# EAGLE design Orbiter_V1 (EAGLE 8.3.2)
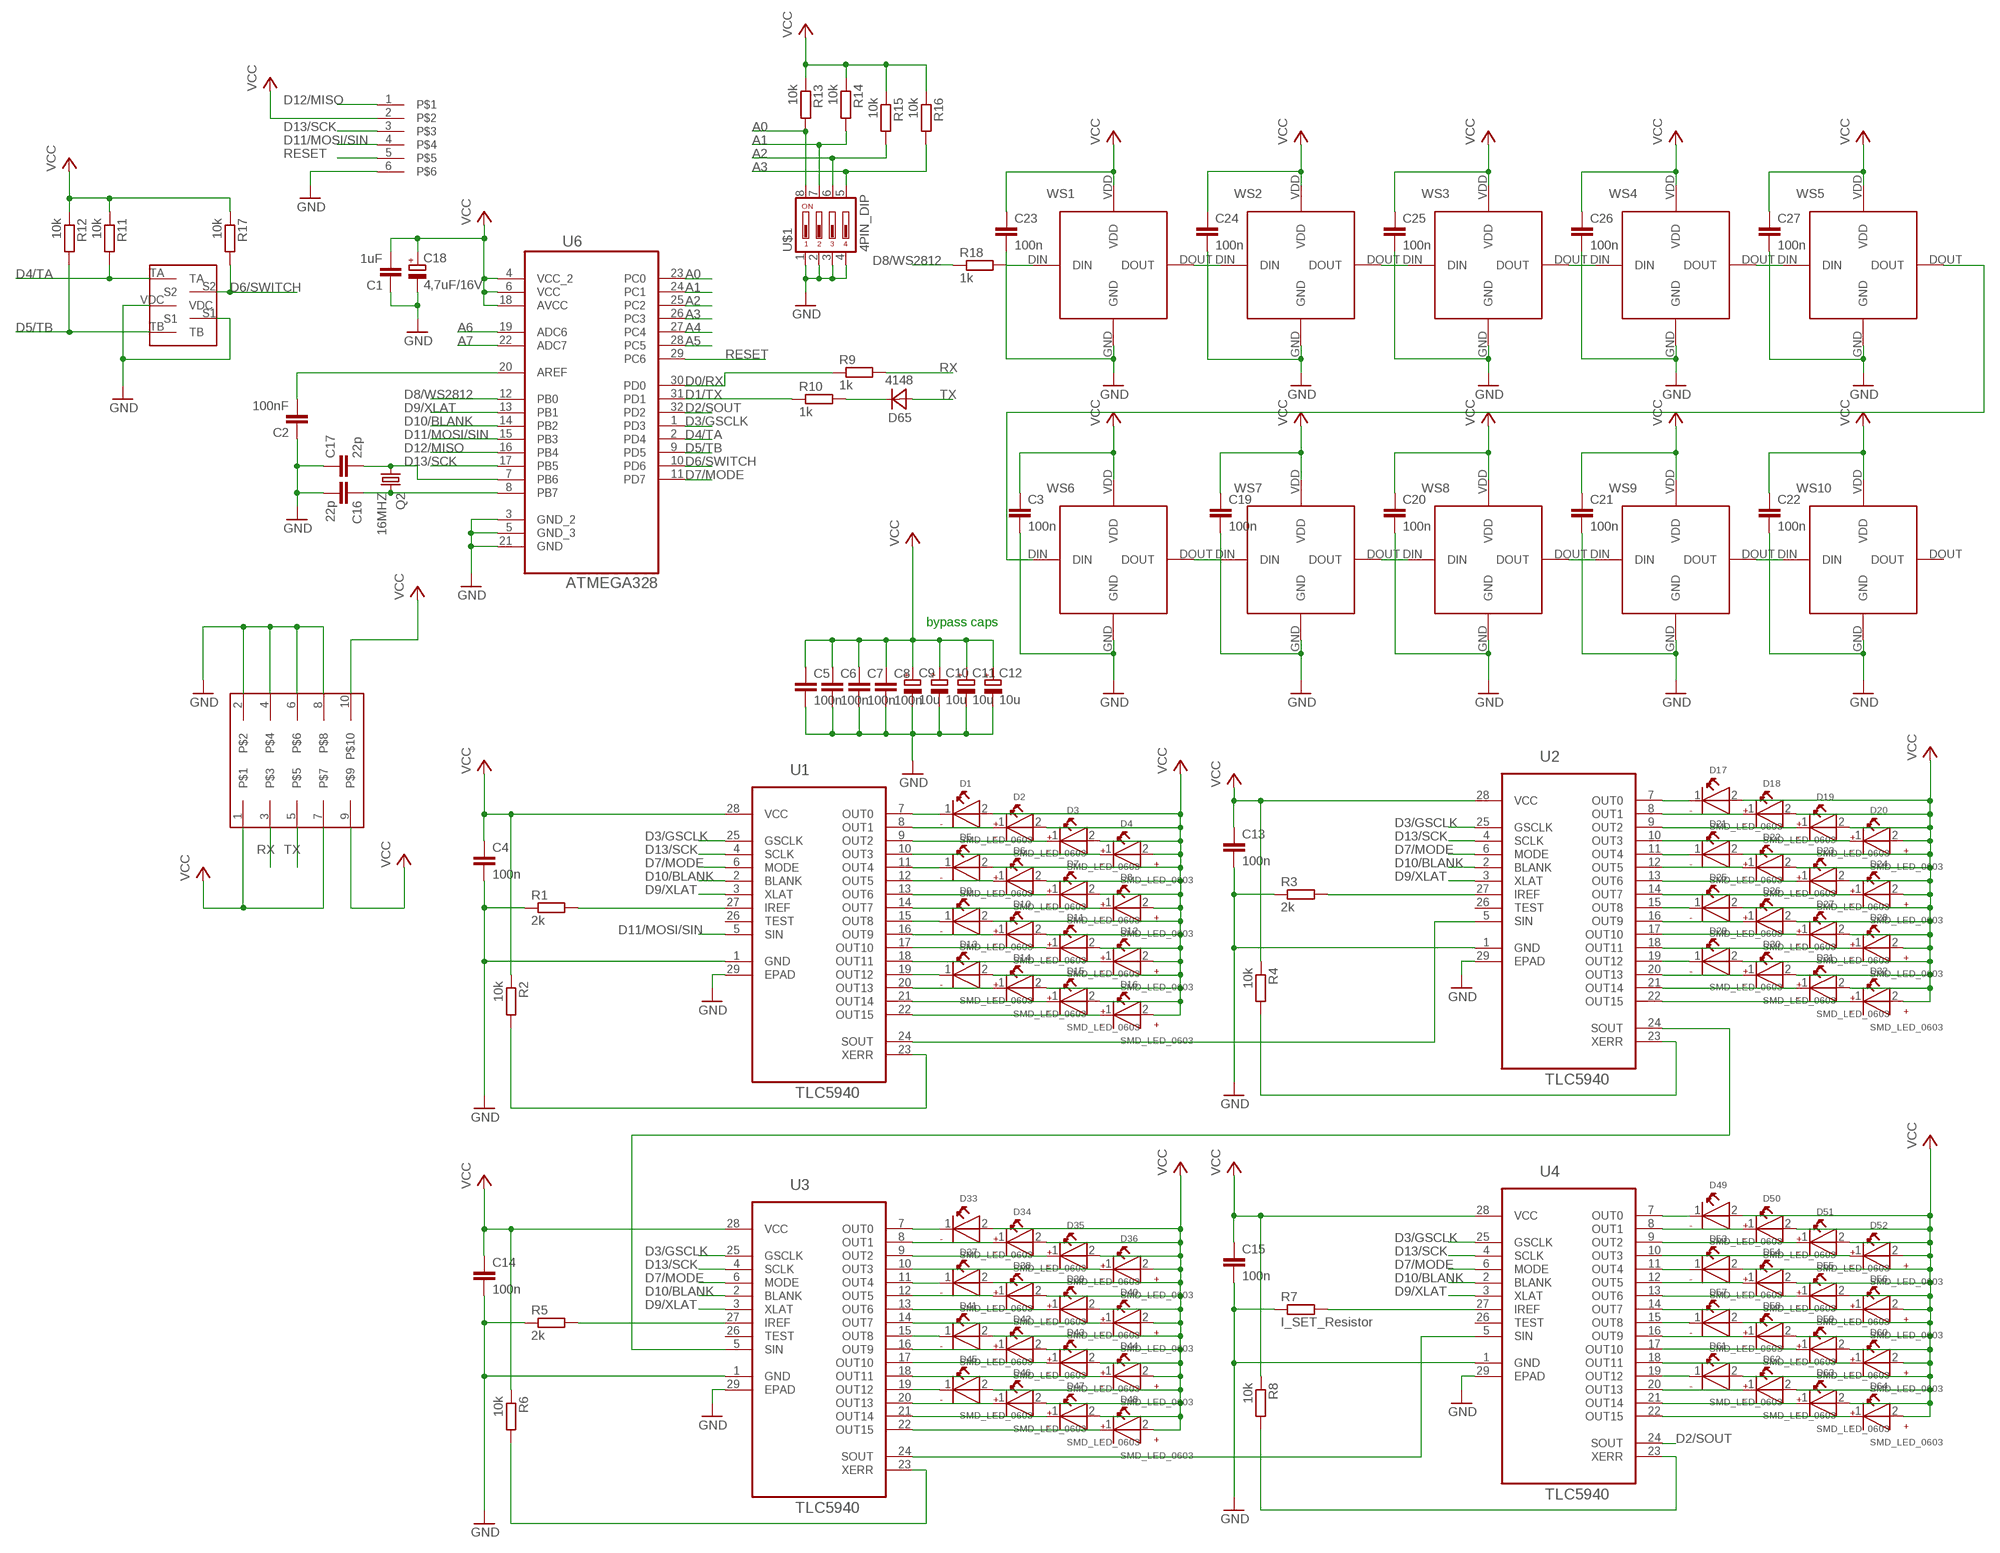
[diagram p0: schematic, sheet 1]

## Parts
C1  1uF  KONDENSATOR_0603  [C0603]
C2  100nF  KONDENSATOR_0603  [C0603]
C3  100n  KONDENSATOR_0603  [C0603]
C4  100n  KONDENSATOR_0603  [C0603]
C5  100n  KONDENSATOR_0603  [C0603]
C6  100n  KONDENSATOR_0603  [C0603]
C7  100n  KONDENSATOR_0603  [C0603]
C8  100n  KONDENSATOR_0603  [C0603]
C9  10u  SMD_ELCTROLYTIC  [153CLV-0605]
C10  10u  SMD_ELCTROLYTIC  [153CLV-0605]
C11  10u  SMD_ELCTROLYTIC  [153CLV-0605]
C12  10u  SMD_ELCTROLYTIC  [153CLV-0605]
C13  100n  KONDENSATOR_0603  [C0603]
C14  100n  KONDENSATOR_0603  [C0603]
C15  100n  KONDENSATOR_0603  [C0603]
C16  22p  KONDENSATOR_0603  [C0603]
C17  22p  KONDENSATOR_0603  [C0603]
C18  4,7uF/16V  SMD_ELCTROLYTIC  [153CLV-0605]
C19  100n  KONDENSATOR_0603  [C0603]
C20  100n  KONDENSATOR_0603  [C0603]
C21  100n  KONDENSATOR_0603  [C0603]
C22  100n  KONDENSATOR_0603  [C0603]
C23  100n  KONDENSATOR_0603  [C0603]
C24  100n  KONDENSATOR_0603  [C0603]
C25  100n  KONDENSATOR_0603  [C0603]
C26  100n  KONDENSATOR_0603  [C0603]
C27  100n  KONDENSATOR_0603  [C0603]
D1  SMD_LED_0603  [WL-SMCW_0603]
D2  SMD_LED_0603  [WL-SMCW_0603]
D3  SMD_LED_0603  [WL-SMCW_0603]
D4  SMD_LED_0603  [WL-SMCW_0603]
D5  SMD_LED_0603  [WL-SMCW_0603]
D6  SMD_LED_0603  [WL-SMCW_0603]
D7  SMD_LED_0603  [WL-SMCW_0603]
D8  SMD_LED_0603  [WL-SMCW_0603]
D9  SMD_LED_0603  [WL-SMCW_0603]
D10  SMD_LED_0603  [WL-SMCW_0603]
D11  SMD_LED_0603  [WL-SMCW_0603]
D12  SMD_LED_0603  [WL-SMCW_0603]
D13  SMD_LED_0603  [WL-SMCW_0603]
D14  SMD_LED_0603  [WL-SMCW_0603]
D15  SMD_LED_0603  [WL-SMCW_0603]
D16  SMD_LED_0603  [WL-SMCW_0603]
D17  SMD_LED_0603  [WL-SMCW_0603]
D18  SMD_LED_0603  [WL-SMCW_0603]
D19  SMD_LED_0603  [WL-SMCW_0603]
D20  SMD_LED_0603  [WL-SMCW_0603]
D21  SMD_LED_0603  [WL-SMCW_0603]
D22  SMD_LED_0603  [WL-SMCW_0603]
D23  SMD_LED_0603  [WL-SMCW_0603]
D24  SMD_LED_0603  [WL-SMCW_0603]
D25  SMD_LED_0603  [WL-SMCW_0603]
D26  SMD_LED_0603  [WL-SMCW_0603]
D27  SMD_LED_0603  [WL-SMCW_0603]
D28  SMD_LED_0603  [WL-SMCW_0603]
D29  SMD_LED_0603  [WL-SMCW_0603]
D30  SMD_LED_0603  [WL-SMCW_0603]
D31  SMD_LED_0603  [WL-SMCW_0603]
D32  SMD_LED_0603  [WL-SMCW_0603]
D33  SMD_LED_0603  [WL-SMCW_0603]
D34  SMD_LED_0603  [WL-SMCW_0603]
D35  SMD_LED_0603  [WL-SMCW_0603]
D36  SMD_LED_0603  [WL-SMCW_0603]
D37  SMD_LED_0603  [WL-SMCW_0603]
D38  SMD_LED_0603  [WL-SMCW_0603]
D39  SMD_LED_0603  [WL-SMCW_0603]
D40  SMD_LED_0603  [WL-SMCW_0603]
D41  SMD_LED_0603  [WL-SMCW_0603]
D42  SMD_LED_0603  [WL-SMCW_0603]
D43  SMD_LED_0603  [WL-SMCW_0603]
D44  SMD_LED_0603  [WL-SMCW_0603]
D45  SMD_LED_0603  [WL-SMCW_0603]
D46  SMD_LED_0603  [WL-SMCW_0603]
D47  SMD_LED_0603  [WL-SMCW_0603]
D48  SMD_LED_0603  [WL-SMCW_0603]
D49  SMD_LED_0603  [WL-SMCW_0603]
D50  SMD_LED_0603  [WL-SMCW_0603]
D51  SMD_LED_0603  [WL-SMCW_0603]
D52  SMD_LED_0603  [WL-SMCW_0603]
D53  SMD_LED_0603  [WL-SMCW_0603]
D54  SMD_LED_0603  [WL-SMCW_0603]
D55  SMD_LED_0603  [WL-SMCW_0603]
D56  SMD_LED_0603  [WL-SMCW_0603]
D57  SMD_LED_0603  [WL-SMCW_0603]
D58  SMD_LED_0603  [WL-SMCW_0603]
D59  SMD_LED_0603  [WL-SMCW_0603]
D60  SMD_LED_0603  [WL-SMCW_0603]
D61  SMD_LED_0603  [WL-SMCW_0603]
D62  SMD_LED_0603  [WL-SMCW_0603]
D63  SMD_LED_0603  [WL-SMCW_0603]
D64  SMD_LED_0603  [WL-SMCW_0603]
D65  4148  4148_SOD323  [SOD323-R]
Q2  16MHZ  CRYSTAL_SM49  [SM49]
R1  2k  WIDERSTAND_0805R0805  [R0805]
R2  10k  WIDERSTAND_0805R0805  [R0805]
R3  2k  WIDERSTAND_0805R0805  [R0805]
R4  10k  WIDERSTAND_0805R0805  [R0805]
R5  2k  WIDERSTAND_0805R0805  [R0805]
R6  10k  WIDERSTAND_0805R0805  [R0805]
R7  I_SET_Resistor  WIDERSTAND_0805R0805  [R0805]
R8  10k  WIDERSTAND_0805R0805  [R0805]
R9  1k  WIDERSTAND_0805R0805  [R0805]
R10  1k  WIDERSTAND_0805R0805  [R0805]
R11  10k  WIDERSTAND_0805R0805  [R0805]
R12  10k  WIDERSTAND_0805R0805  [R0805]
R13  10k  WIDERSTAND_0805R0805  [R0805]
R14  10k  WIDERSTAND_0805R0805  [R0805]
R15  10k  WIDERSTAND_0805R0805  [R0805]
R16  10k  WIDERSTAND_0805R0805  [R0805]
R17  10k  WIDERSTAND_0805R0805  [R0805]
R18  1k  WIDERSTAND_0805R0805  [R0805]
U1  TLC5940  TLC59401PWP  [SOP65P640X120-29N]
U2  TLC5940  TLC59401PWP  [SOP65P640X120-29N]
U3  TLC5940  TLC59401PWP  [SOP65P640X120-29N]
U4  TLC5940  TLC59401PWP  [SOP65P640X120-29N]
U6  ATMEGA328  ATMEGA328P-AU  [QFP80P900X900X120-32N]
U$1  4PIN_DIP  [CTS-219-04]
U$2  10PIN_HEADER_SMD  [87832-10]
U$3  6PIN_HEADER_SMD_OPEN  [6PIN_HEADER_SMD_OPEN]
U$4  BOURNS_ENCODER  [BOURNS_ENCODER_SMD]
WS1  WS2812  [WS2812]
WS2  WS2812  [WS2812]
WS3  WS2812  [WS2812]
WS4  WS2812  [WS2812]
WS5  WS2812  [WS2812]
WS6  WS2812  [WS2812]
WS7  WS2812  [WS2812]
WS8  WS2812  [WS2812]
WS9  WS2812  [WS2812]
WS10  WS2812  [WS2812]

## Nets
A0: R13.2 U6.23(PC0) U$1.8
A1: R14.2 U6.24(PC1) U$1.7
A2: R15.2 U6.25(PC2) U$1.6
A3: R16.2 U6.26(PC3) U$1.5
A4: U6.27(PC4)
A5: U6.28(PC5)
A6: U6.19(ADC6)
A7: U6.22(ADC7)
D0/RX: R9.1 U6.30(PD0)
D1/TX: R10.1 U6.31(PD1)
D2/SOUT: U4.24(SOUT) U6.32(PD2)
D3/GSCLK: U1.25(GSCLK) U2.25(GSCLK) U3.25(GSCLK) U4.25(GSCLK) U6.1(PD3)
D4/TA: R11.2 U6.2(PD4) U$4.TA
D5/TB: R12.2 U6.9(PD5) U$4.TB
D6/SWITCH: R17.2 U6.10(PD6) U$4.S2
D7/MODE: U1.6(MODE) U2.6(MODE) U3.6(MODE) U4.6(MODE) U6.11(PD7)
D8/WS2812: R18.1 U6.12(PB0)
D9/XLAT: U1.3(XLAT) U2.3(XLAT) U3.3(XLAT) U4.3(XLAT) U6.13(PB1)
D10/BLANK: U1.2(BLANK) U2.2(BLANK) U3.2(BLANK) U4.2(BLANK) U6.14(PB2)
D11/MOSI/SIN: U1.5(SIN) U6.15(PB3) U$3.4
D12/MISO: U6.16(PB4) U$3.1
D13/SCK: U1.4(SCLK) U2.4(SCLK) U3.4(SCLK) U4.4(SCLK) U6.17(PB5) U$3.3
GND: C1.1 C2.1 C3.2 C4.2 C5.2 C6.2 C7.2 C8.2 C9.- C10.- C11.- C12.- C13.2 C14.2 C15.2 C16.2 C17.1 C18.- C19.2 C20.2 C21.2 C22.2 C23.2 C24.2 C25.2 C26.2 C27.2 R1.1 R3.1 R5.1 R7.1 U1.1(GND) U1.29(EPAD) U2.1(GND) U2.29(EPAD) U3.1(GND) U3.29(EPAD) U4.1(GND) U4.29(EPAD) U6.3(GND_2) U6.5(GND_3) U6.21(GND) U$1.1 U$1.2 U$1.3 U$1.4 U$2.2 U$2.4 U$2.6 U$2.8 U$3.6 U$4.S1 U$4.VDC WS1.GND WS2.GND WS3.GND WS4.GND WS5.GND WS6.GND WS7.GND WS8.GND WS9.GND WS10.GND
N$1: D1.1(-) U1.7(OUT0)
N$2: R1.2 U1.27(IREF)
N$3: D2.1(-) U1.8(OUT1)
N$4: D8.1(-) U1.14(OUT7)
N$5: D3.1(-) U1.9(OUT2)
N$6: D9.1(-) U1.15(OUT8)
N$7: D4.1(-) U1.10(OUT3)
N$8: D10.1(-) U1.16(OUT9)
N$9: D5.1(-) U1.11(OUT4)
N$10: D6.1(-) U1.12(OUT5)
N$11: D7.1(-) U1.13(OUT6)
N$12: D11.1(-) U1.17(OUT10)
N$13: D12.1(-) U1.18(OUT11)
N$14: D13.1(-) U1.19(OUT12)
N$15: D14.1(-) U1.20(OUT13)
N$16: D15.1(-) U1.21(OUT14)
N$17: D16.1(-) U1.22(OUT15)
N$18: R2.2 U1.23(XERR)
N$19: D17.1(-) U2.7(OUT0)
N$20: D18.1(-) U2.8(OUT1)
N$21: D19.1(-) U2.9(OUT2)
N$22: D20.1(-) U2.10(OUT3)
N$23: D21.1(-) U2.11(OUT4)
N$24: D22.1(-) U2.12(OUT5)
N$25: D23.1(-) U2.13(OUT6)
N$26: D24.1(-) U2.14(OUT7)
N$27: D25.1(-) U2.15(OUT8)
N$28: D26.1(-) U2.16(OUT9)
N$29: D27.1(-) U2.17(OUT10)
N$30: U1.24(SOUT) U2.5(SIN)
N$31: D28.1(-) U2.18(OUT11)
N$32: D29.1(-) U2.19(OUT12)
N$33: D30.1(-) U2.20(OUT13)
N$34: D31.1(-) U2.21(OUT14)
N$35: D32.1(-) U2.22(OUT15)
N$36: R3.2 U2.27(IREF)
N$37: R4.2 U2.23(XERR)
N$38: U2.24(SOUT) U3.5(SIN)
N$39: D33.1(-) U3.7(OUT0)
N$40: D34.1(-) U3.8(OUT1)
N$41: D35.1(-) U3.9(OUT2)
N$42: D36.1(-) U3.10(OUT3)
N$43: D37.1(-) U3.11(OUT4)
N$44: D38.1(-) U3.12(OUT5)
N$45: D39.1(-) U3.13(OUT6)
N$46: D40.1(-) U3.14(OUT7)
N$47: D41.1(-) U3.15(OUT8)
N$48: D42.1(-) U3.16(OUT9)
N$49: D43.1(-) U3.17(OUT10)
N$50: D44.1(-) U3.18(OUT11)
N$51: D45.1(-) U3.19(OUT12)
N$52: D46.1(-) U3.20(OUT13)
N$53: D47.1(-) U3.21(OUT14)
N$54: D48.1(-) U3.22(OUT15)
N$55: R5.2 U3.27(IREF)
N$56: R6.2 U3.23(XERR)
N$57: U3.24(SOUT) U4.5(SIN)
N$58: D49.1(-) U4.7(OUT0)
N$59: D50.1(-) U4.8(OUT1)
N$60: D51.1(-) U4.9(OUT2)
N$61: D52.1(-) U4.10(OUT3)
N$62: D53.1(-) U4.11(OUT4)
N$63: D54.1(-) U4.12(OUT5)
N$64: D55.1(-) U4.13(OUT6)
N$65: D56.1(-) U4.14(OUT7)
N$66: D57.1(-) U4.15(OUT8)
N$67: D58.1(-) U4.16(OUT9)
N$68: D59.1(-) U4.17(OUT10)
N$69: D60.1(-) U4.18(OUT11)
N$70: D61.1(-) U4.19(OUT12)
N$71: D62.1(-) U4.20(OUT13)
N$72: D63.1(-) U4.21(OUT14)
N$73: D64.1(-) U4.22(OUT15)
N$74: R7.2 U4.27(IREF)
N$75: R8.2 U4.23(XERR)
N$76: WS1.DOUT WS2.DIN
N$77: D65.C R10.2
N$78: R18.2 WS1.DIN
N$79: WS2.DOUT WS3.DIN
N$80: WS3.DOUT WS4.DIN
N$81: C17.2 Q2.1 U6.7(PB6)
N$82: C16.1 Q2.2 U6.8(PB7)
N$83: WS4.DOUT WS5.DIN
N$84: WS5.DOUT WS6.DIN
N$85: WS6.DOUT WS7.DIN
N$86: WS7.DOUT WS8.DIN
N$87: WS8.DOUT WS9.DIN
N$88: WS9.DOUT WS10.DIN
N$90: C2.2 U6.20(AREF)
RESET: U6.29(PC6) U$3.5
RX: R9.2 U$2.3
TX: D65.A U$2.5
VCC: C1.2 C3.1 C4.1 C5.1 C6.1 C7.1 C8.1 C9.+ C10.+ C11.+ C12.+ C13.1 C14.1 C15.1 C18.+ C19.1 C20.1 C21.1 C22.1 C23.1 C24.1 C25.1 C26.1 C27.1 D1.2(+) D2.2(+) D3.2(+) D4.2(+) D5.2(+) D6.2(+) D7.2(+) D8.2(+) D9.2(+) D10.2(+) D11.2(+) D12.2(+) D13.2(+) D14.2(+) D15.2(+) D16.2(+) D17.2(+) D18.2(+) D19.2(+) D20.2(+) D21.2(+) D22.2(+) D23.2(+) D24.2(+) D25.2(+) D26.2(+) D27.2(+) D28.2(+) D29.2(+) D30.2(+) D31.2(+) D32.2(+) D33.2(+) D34.2(+) D35.2(+) D36.2(+) D37.2(+) D38.2(+) D39.2(+) D40.2(+) D41.2(+) D42.2(+) D43.2(+) D44.2(+) D45.2(+) D46.2(+) D47.2(+) D48.2(+) D49.2(+) D50.2(+) D51.2(+) D52.2(+) D53.2(+) D54.2(+) D55.2(+) D56.2(+) D57.2(+) D58.2(+) D59.2(+) D60.2(+) D61.2(+) D62.2(+) D63.2(+) D64.2(+) R2.1 R4.1 R6.1 R8.1 R11.1 R12.1 R13.1 R14.1 R15.1 R16.1 R17.1 U1.28(VCC) U2.28(VCC) U3.28(VCC) U4.28(VCC) U6.4(VCC_2) U6.6(VCC) U6.18(AVCC) U$2.1 U$2.7 U$2.9 U$2.10 U$3.2 WS1.VDD WS2.VDD WS3.VDD WS4.VDD WS5.VDD WS6.VDD WS7.VDD WS8.VDD WS9.VDD WS10.VDD
Unconnected: U1.26(TEST) U2.26(TEST) U3.26(TEST) U4.26(TEST) WS10.DOUT

## Notes on the sheet
- bypass caps

## Library data of the parts
C1-C8 C13-C17 C19-C27 = C_Sager_Bibliothek:KONDENSATOR_0603
C9-C12 C18 = C_Sager_Bibliothek:SMD_ELCTROLYTIC
D1-D64 = C_Sager_Bibliothek:SMD_LED_0603
D65 = C_Sager_Bibliothek:4148_SOD323
Q2 = C_Sager_Bibliothek:CRYSTAL_SM49
R1-R18 = C_Sager_Bibliothek:WIDERSTAND_0805: RESISTOR, European symbol
U1-U4 = C_Sager_Bibliothek:TLC59401PWP: 16-CHANNEL LED DRIVER; MPN: TLC59401PWP; OC_FARNELL: -; OC_NEWARK: 64R0661; PACKAGE: TSSOP-28; SUPPLIER: Texas Instruments
U6 = C_Sager_Bibliothek:ATMEGA328P-AU: 8-bit Microcontroller with In-System Programmable Flash; MPN: ATMEGA328P-AU; OC_FARNELL: 1715486; OC_NEWARK: 14R4631; PACKAGE: TQFP-32; SUPPLIER: Atmel
U$1 = C_Sager_Bibliothek:4PIN_DIP
U$2 = C_Sager_Bibliothek:10PIN_HEADER_SMD
U$3 = C_Sager_Bibliothek:6PIN_HEADER_SMD_OPEN
U$4 = C_Sager_Bibliothek:BOURNS_ENCODER
WS1-WS10 = C_Sager_Bibliothek:WS2812

## Board
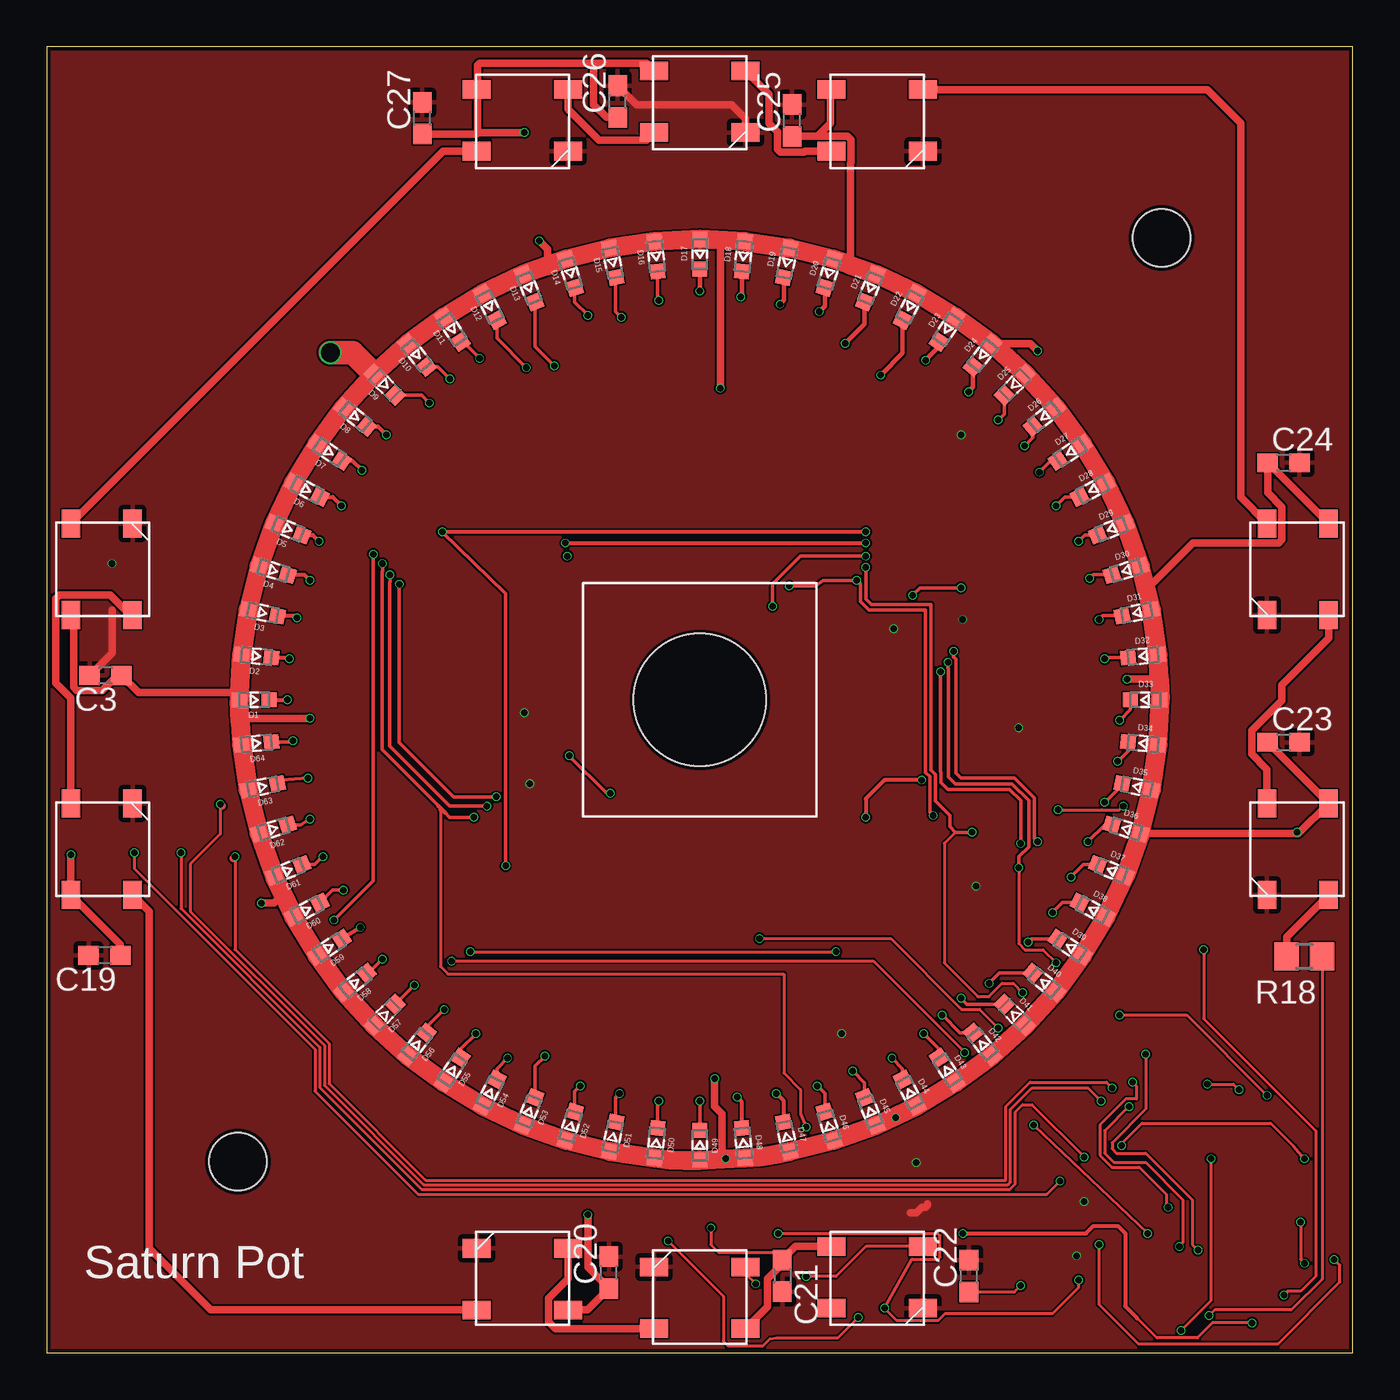
[diagram p1: board, top side]
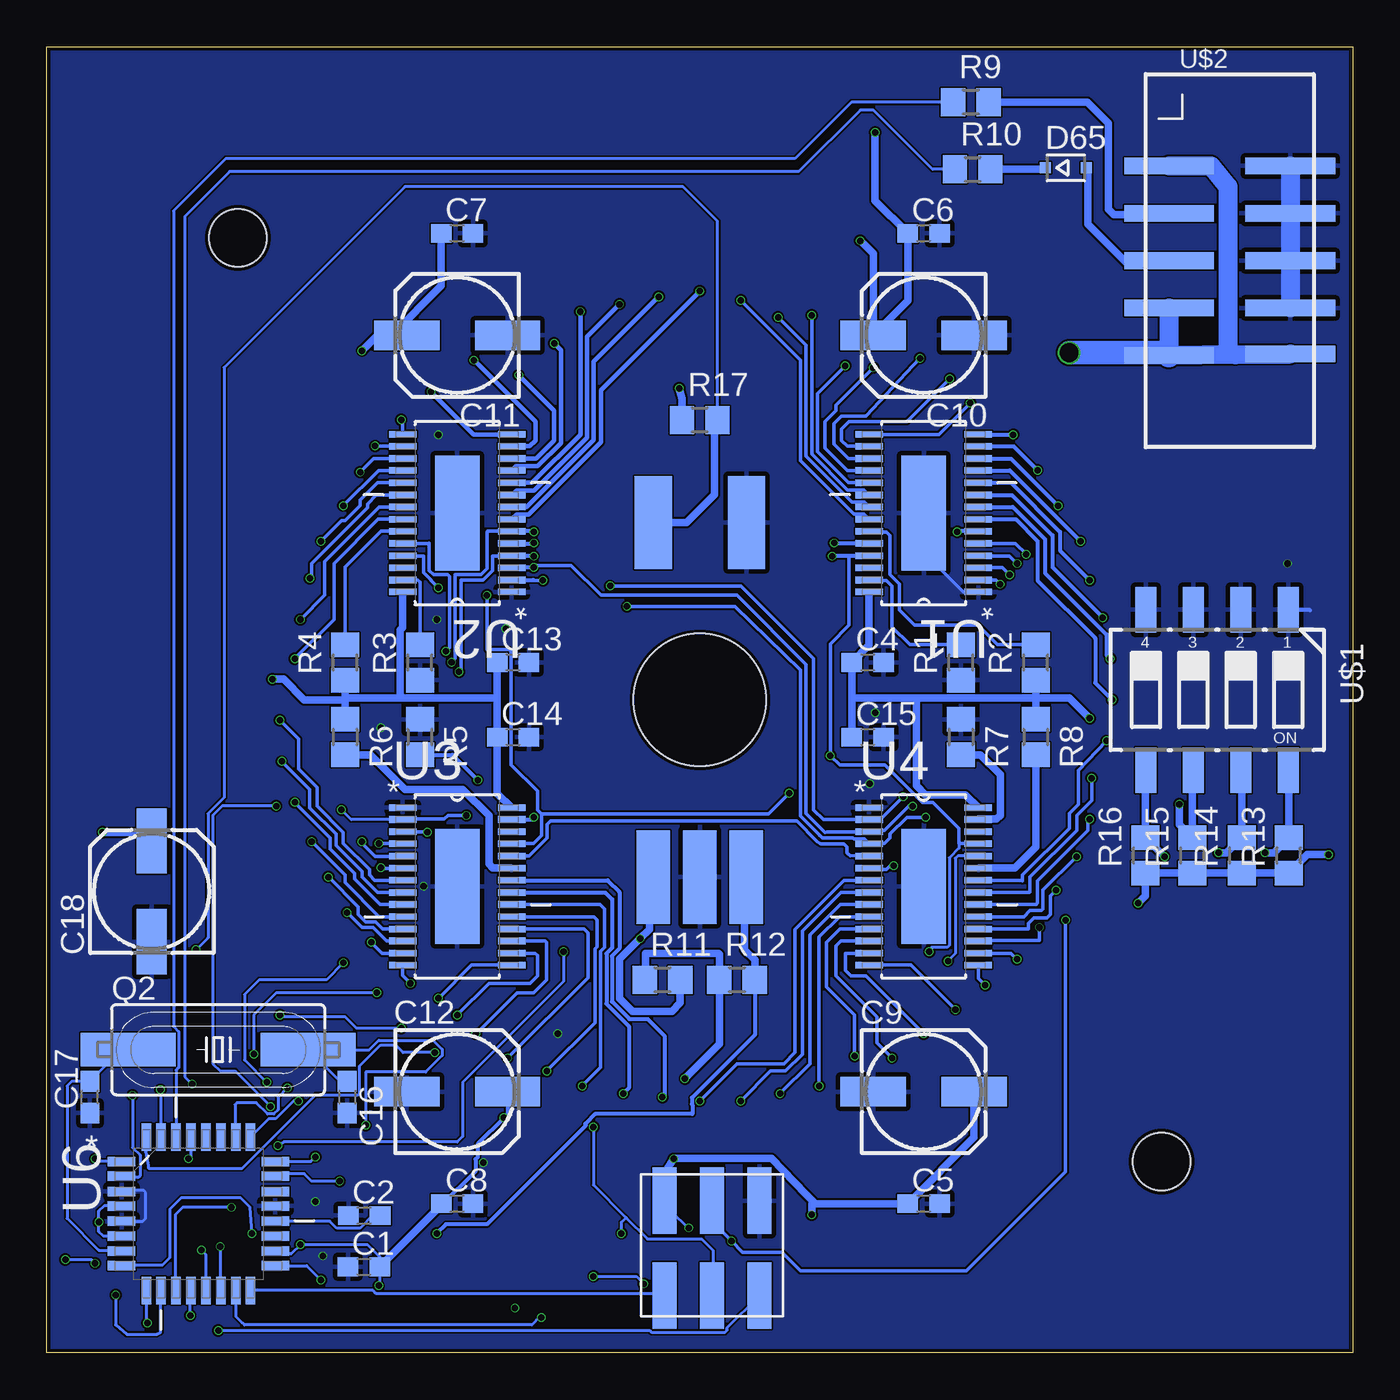
[diagram p2: board, bottom side, seen from below]

Size 70 x 70 mm. Coordinates in mm from the lower left corner, seen from the top.
Outline: 0,0 70,0 70,70 0,70 0,0
Copper layers (1*16): Top 0.035mm / dielectric 1.5mm / Bottom 0.035mm
Design rules "aisler_go_2layer": minimum track width 0.1mm, minimum drill 0.2mm, track to track 0.1mm, track to pad 0.1mm, pad to pad 0.1mm, via to via 0.1mm, smd to smd 0.1mm, copper to edge 0.2mm, drill to drill 0.21mm, minimum pad ring 0.25mm, minimum via ring 0.05mm, stop-mask expansion 0.01mm, vias tented up to drill 0mil, thermal gap 10mil
Holes 3.1 mm at 10.25,10.25 59.75,59.75

### Footprints (pad centres in the part's own frame; a part is rotated, then mirrored left to right if it is on the bottom)
C0603 = smd 1.1 x 1: 1 -0.85,0; 2 0.85,0
153CLV-0605 = smd 3.5 x 1.6: + 2.7,0; - -2.7,0
WL-SMCW_0603 = smd 0.8 x 0.8: 1 -0.8,0; 2 0.8,0
SOD323-R = smd 0.6 x 0.6: A 1.1,0; C -1.1,0
SM49 = smd 5.08 x 1.778: 1 -4.826,0; 2 4.826,0
R0805 = smd 1.3 x 1.5: 1 -0.95,0; 2 0.95,0
SOP65P640X120-29N = smd 1.473 x 0.356: 1 -2.921,4.216; 2 -2.921,3.581; 3 -2.921,2.921; 4 -2.921,2.286; 5 -2.921,1.626; 6 -2.921,0.965; 7 -2.921,0.33; 8 -2.921,-0.33; 9 -2.921,-0.965; 10 -2.921,-1.626; 11 -2.921,-2.286; 12 -2.921,-2.921; 13 -2.921,-3.581; 14 -2.921,-4.216; 15 2.921,-4.216; 16 2.921,-3.581; 17 2.921,-2.921; 18 2.921,-2.286; 19 2.921,-1.626; 20 2.921,-0.965; 21 2.921,-0.33; 22 2.921,0.33; 23 2.921,0.965; 24 2.921,1.626; 25 2.921,2.286; 26 2.921,2.921; 27 2.921,3.581; 28 2.921,4.216 | smd 2.388 x 6.172: 29 0,0
QFP80P900X900X120-32N = smd 1.473 x 0.508: 1 -4.115,2.794; 2 -4.115,2.007; 3 -4.115,1.194; 4 -4.115,0.406; 5 -4.115,-0.406; 6 -4.115,-1.194; 7 -4.115,-2.007; 8 -4.115,-2.794; 17 4.115,-2.794; 18 4.115,-2.007; 19 4.115,-1.194; 20 4.115,-0.406; 21 4.115,0.406; 22 4.115,1.194; 23 4.115,2.007; 24 4.115,2.794 | smd 0.508 x 1.473: 9 -2.794,-4.115; 10 -2.007,-4.115; 11 -1.194,-4.115; 12 -0.406,-4.115; 13 0.406,-4.115; 14 1.194,-4.115; 15 2.007,-4.115; 16 2.794,-4.115; 25 2.794,4.115; 26 2.007,4.115; 27 1.194,4.115; 28 0.406,4.115; 29 -0.406,4.115; 30 -1.194,4.115; 31 -2.007,4.115; 32 -2.794,4.115
CTS-219-04 = smd 1.13 x 2.44: 1 -3.81,-4.3; 2 -1.27,-4.3; 3 1.27,-4.3; 4 3.81,-4.3; 5 3.81,4.3; 6 1.27,4.3; 7 -1.27,4.3; 8 -3.81,4.3
87832-10 = smd 0.89 x 4.8: 1 -5.08,-3.251; 2 -5.08,3.249; 3 -2.54,-3.251; 4 -2.54,3.249; 5 0,-3.251; 6 0,3.249; 7 2.54,-3.251; 8 2.54,3.249; 9 5.08,-3.251; 10 5,3.249
6PIN_HEADER_SMD_OPEN = smd 1.27 x 3.56: 1 -2.54,-2.7; 2 -2.54,2.38; 3 0,-2.7; 4 0,2.38; 5 2.54,-2.7; 6 2.54,2.38
BOURNS_ENCODER_SMD = smd 2 x 5 bottom: S1 -2.5,9.5; S2 2.5,9.5 | smd 1.8 x 5 bottom: TA 2.5,-9.5; TB -2.5,-9.5; VDC 0,-9.5 | hole 7.1: 0,0
WS2812 = smd 1.5 x 1: DIN 2.45,1.7; DOUT -2.45,-1.6; GND 2.45,-1.6; VDD -2.45,1.7

### Placement (x,y rotation side)
C1  53,4.61 0 bottom
C2  52.98,7.36 0 bottom
C3  3.15,36.3 180 top
C4  26,37 0 bottom
C5  23,8 0 bottom
C6  23,60 0 bottom
C7  48,60 0 bottom
C8  48,8 0 bottom
C9  23,14 0 bottom
C10  23,54.53 180 bottom
C11  48,54.53 180 bottom
C12  48,14 0 bottom
C13  45,37 0 bottom
C14  45,33 0 bottom
C15  26,33 0 bottom
C16  53.89,13.7 270 bottom
C17  67.68,13.7 90 bottom
C18  64.36,24.73 90 bottom
C19  3.1,21.3 180 top
C20  30.13,4.3 90 top
C21  39.42,4.13 270 top
C22  49.42,4.12 90 top
C23  66.29,32.72 0 top
C24  66.29,47.7 0 top
C25  39.95,66.04 90 top
C26  30.61,67.06 90 top
C27  20.13,66.17 90 top
D1  11.12,35 180 top
D2  11.24,37.34 174.4 top
D3  11.58,39.66 168.8 top
D4  12.15,41.93 163.1 top
D5  12.94,44.14 157.5 top
D6  13.94,46.25 151.9 top
D7  15.15,48.26 146.3 top
D8  16.54,50.15 140.6 top
D9  18.12,51.88 135 top
D10  19.85,53.46 129.4 top
D11  21.74,54.85 123.8 top
D12  23.75,56.06 118.2 top
D13  25.86,57.06 112.5 top
D14  28.07,57.85 106.9 top
D15  30.34,58.42 101.3 top
D16  32.66,58.76 95.6 top
D17  35,58.88 90 top
D18  37.34,58.76 84.4 top
D19  39.66,58.42 78.8 top
D20  41.93,57.85 73.1 top
D21  44.14,57.06 67.5 top
D22  46.25,56.06 61.9 top
D23  48.26,54.85 56.3 top
D24  50.15,53.46 50.6 top
D25  51.88,51.88 45 top
D26  53.46,50.15 39.4 top
D27  54.85,48.26 33.8 top
D28  56.06,46.25 28.1 top
D29  57.06,44.14 22.5 top
D30  57.85,41.93 16.9 top
D31  58.42,39.66 11.3 top
D32  58.76,37.34 5.6 top
D33  58.87,35 0 top
D34  58.76,32.66 354.4 top
D35  58.42,30.34 348.8 top
D36  57.85,28.07 343.1 top
D37  57.06,25.86 337.5 top
D38  56.06,23.75 331.9 top
D39  54.85,21.74 326.3 top
D40  53.46,19.85 320.6 top
D41  51.88,18.12 315 top
D42  50.15,16.54 309.4 top
D43  48.26,15.15 303.8 top
D44  46.25,13.94 298.1 top
D45  44.14,12.94 292.5 top
D46  41.93,12.15 286.9 top
D47  39.66,11.58 281.3 top
D48  37.34,11.24 275.6 top
D49  35,11.13 270 top
D50  32.66,11.24 264.4 top
D51  30.34,11.58 258.8 top
D52  28.07,12.15 253.1 top
D53  25.86,12.94 247.5 top
D54  23.75,13.94 241.9 top
D55  21.74,15.15 236.3 top
D56  19.85,16.54 230.6 top
D57  18.12,18.12 225 top
D58  16.54,19.85 219.4 top
D59  15.15,21.74 213.8 top
D60  13.94,23.75 208.1 top
D61  12.94,25.86 202.5 top
D62  12.15,28.07 196.9 top
D63  11.58,30.34 191.3 top
D64  11.24,32.66 185.6 top
D65  15.38,63.51 0 bottom
Q2  60.81,16.25 0 bottom
R1  21,37 90 bottom
R2  17,37 90 bottom
R3  50,37 90 bottom
R4  54,37 90 bottom
R5  50,33 270 bottom
R6  54,33 270 bottom
R7  21,33 270 bottom
R8  17,33 270 bottom
R9  20.46,67.03 0 bottom
R10  20.38,63.42 0 bottom
R11  37,20 0 bottom
R12  33,20 0 bottom
R13  3.44,26.66 90 bottom
R14  5.96,26.66 90 bottom
R15  8.6,26.66 90 bottom
R16  11.12,26.66 90 bottom
R17  35,50 0 bottom
R18  67.4,21.25 180 top
U1  23,45 180 bottom
U2  48,45 180 bottom
U3  48,25 0 bottom
U4  23,25 0 bottom
U6  61.87,7.46 0 bottom
U$1  7.28,35.53 180 bottom
U$2  6.6,58.53 270 bottom
U$3  34.34,5.77 0 bottom
U$4  35,35 0 top
WS1  67,27 270 top
WS2  67,42 270 top
WS3  44.5,66 0 top
WS4  35,67 0 top
WS5  25.5,66 0 top
WS6  3,42 90 top
WS7  3,27 90 top
WS8  25.5,4 180 top
WS9  35,3 180 top
WS10  44.5,4 0 top

### Tracks (layer width: path | path; a pad name or v marks a point on that pad's centre or on a via)
A0  (via drill 0.35)
  Top 0.152: v4.7,26.8 4.7,25.95 14.38,16.27 14.38,14.02 19.9,8.5 53.6,8.5 v54.3,9.2
  Bottom 0.152: v54.3,9.2 55.8,9.2 56.2,9.6 57.62,9.6 U6.23
  Bottom 0.406: U$1.8 3.44,31.2 R13.2 4.25,26.8 v4.7,26.8
A1  (via drill 0.35)
  Top 0.152: v7.2,26.8 7.2,23.81 14.63,16.37 14.63,14.22 20.1,8.75 51,8.75 | 51,8.75 51.3,8.75 | 51.61,8.75 51.91,9.05 51.91,12.91 52.3,13.3 52.8,13.3 v55.6,10.5 | 51.35,8.75 51.61,8.75 | 51,8.75 51.61,8.75
  Bottom 0.152: v55.6,10.5 55.85,10.25 U6.24
  Bottom 0.406: U$1.7 5.96,31.18 R14.2 6.77,26.8 v7.2,26.8
A2  (via drill 0.35)
  Top 0.152: v9.3,29.4 9.3,27.8 7.7,26.2 7.7,23.66 14.88,16.48 14.88,14.32 20.2,9.01 51.51,9.01 51.66,9.15 51.66,13.06 52.8,14.2 55.8,14.2 v56.5,13.5
  Top 0.406: 9.4,29.3 v9.3,29.4
  Bottom 0.152: U6.25 58.1,12.55 57.73,12.55 56.78,13.5 v56.5,13.5
  Bottom 0.406: U$1.6 8.6,31.18 R15.2 9.3,28.31 v9.3,29.4
A3  (via drill 0.35)
  Top 0.152: v10.1,26.6 10.1,21.62 15.14,16.58 15.14,14.43 20.31,9.26 51.41,9.26 51.41,13.21 52.7,14.5 56.8,14.5 v57.1,14.2
  Top 0.406: 10,26.5 v10.1,26.6
  Bottom 0.152: v57.1,14.2 57.6,13.7 57.6,13.03 57.83,12.8 58.17,12.8 58.77,13.4 59.8,13.4 59.9,13.3 59.9,11.61 U6.26
  Bottom 0.406: U$1.5 11.12,31.2 R16.2 v10.11,26.6 v10.1,26.6
D0/RX
  Bottom 0.152: R9.1 26.87,67.03 29.9,64 60.4,64 63.2,61.2 63.2,17.49 62.92,17.21 62.92,15.29 63.06,15.14 U6.30
D1/TX  (via drill 0.35)
  Top 0.152: v62.2,14.4 63.6,14.4 v63.9,14.1
  Bottom 0.152: R10.1 22.52,63.42 25.7,66.6 26.4,66.6 29.7,63.3 60.2,63.3 62.6,60.9 62.6,14.8 v62.2,14.4 | v63.9,14.1 63.9,11.6 U6.31
D2/SOUT  (via drill 0.35)
  Top 0.152: v21.7,21 44.3,21 v49.2,16.1
  Bottom 0.152: U4.24 21.17,26.63 21.3,26.5 21.3,21.4 v21.7,21 | v49.2,16.1 50.9,16.1 51.3,16.5 52.1,16.5 53.22,15.38 53.22,13.93 53.32,13.82 55.58,13.82 59.51,9.9 64.54,9.9 64.7,10.77 64.7,11.22 U6.32
D3/GSCLK  (via drill 0.35)
  Top 0.152: v22.7,21.5 v42.3,21.5 | v67.4,10.4 66.8,11.1 65.6,12.3 58.7,12.3 57.6,11.2 v57.6,11.1
  Top 0.2: v49,41 46.8,41 v46.4,40.6 | v30.2,30 30,30 v28,32
  Bottom 0.152: v22.7,21.5 22.56,21.74 21.73,21.74 21.63,21.84 21.63,26.53 21.1,27.06 21.1,27.3 | v42.3,21.5 42.3,19.9 47.7,14.5 47.7,11.6 48,11.3 57.3,11.3 v57.6,11.1 | U6.1 67.25,10.25 v67.4,10.4
  Bottom 0.2: 27,42.71 27,39 28,38 v28,32 27.5,31.5 25.07,31.5 23.07,29.5 22.5,29.5 21.1,28.1 21.1,27.3 20.09,27.3 U4.25 | U2.25 49.81,42.71 49.8,42.7 49.8,41.81 49.4,41.41 49.4,41.4 v49,41 | v46.4,40.6 46.4,37.7 45.22,37.7 45.1,37.58 45.1,31.5 43.7,30.1 43.7,29.1 43.48,28.88 | 43.48,28.88 43.48,27.73 43.9,27.3 45.06,27.3 U3.25 | 43.48,28.88 31.32,28.88 v30.2,30
  Bottom 0.203: U1.25 27,42.71 27.89,42.71 v27.9,42.7
D4/TA  (via drill 0.35)
  Top 0.152: v51,17.4 49.99,18.41 49.02,18.41 45.23,22.2 v38.2,22.2 | v57.5,18.1 61.1,18.1 v65.4,13.8
  Bottom 0.152: v51,17.4 53.4,17.4 54,18 57.4,18 v57.5,18.1 | v65.4,13.8 65.4,11 65,10.6 65,9.5 65.1,9.4 65.92,9.4 U6.2
  Bottom 0.406: R11.2 36.05,18.75 36.5,18.3 38.6,18.3 39.3,19 39.3,21.1 v38.2,22.2 37.7,22.7 37.7,25.3 U$4.TA
D5/TB  (via drill 0.35)
  Top 0.152: v64.6,1.6 62.47,1.6 61.67,0.8 59.5,0.8 58.45,1.85 58.2,2.1
  Top 0.203: v49.1,6.4 55.7,6.4 56.1,6.8 57.4,6.8 57.8,6.4 57.8,2.5 58.45,1.85
  Bottom 0.152: U6.9 64.66,1.66 v64.6,1.6
  Bottom 0.203: R12.2 32.05,17.05 35.43,13.68 35.43,13.32 35.4,13.3 35.4,12.8 40.6,12.8 41.13,12.28 41.13,12.17 46.4,6.9 48.6,6.9 v49.1,6.4
  Bottom 0.406: R12.2 32.05,21.05 32.6,21.6 32.6,24.4 32.7,24.5 32.7,24.2 32.5,24 U$4.TB
D6/SWITCH  (via drill 0.35)
  Top 0.152: v62,21.6 62,17.9 68,11.9 68,4.1 67.2,3.3 66.5,3.3 v66.3,3.1
  Bottom 0.152: R17.2 34.05,60.65 35.9,62.5 50.8,62.5 60.5,52.8 60.5,29.76 61.35,28.91 61.35,22.25 v62,21.6 | v66.3,3.1 66.3,1.5 65.7,1 64.1,1 63.9,1.1 63.9,3.32 U6.10
  Bottom 0.406: U$4.S2 35.7,44.5 34.2,46 34.2,49.85 R17.2
D7/MODE  (via drill 0.35)
  Top 0.152: v54.1,20.9 53.4,21.6 52.43,21.6 52.1,21.93 v52.1,26 | v58.2,14.5 58.4,14.3 58.4,13.6 57.83,13.6 56.45,12.21 56.45,10.6 57.09,9.95 58.55,9.95 60,8.5 60,7.9 v60.1,7.8
  Top 0.2: v21.2,44 24.6,40.7 v24.6,26.1 | v48.3,37 48.3,36.7 48.33,36.68 48.33,30.88 48.7,30.5 51.72,30.5 52.62,29.6 52.62,27.12 52.1,26.6 v52.1,26
  Top 0.203: v43.9,44 v21.2,44
  Bottom 0.152: v54.1,20.9 55,20 58.6,20 59.4,19.2 59.4,15.7 v58.2,14.5 | v60.1,7.8 62.7,7.8 63.1,7.4 63.1,3.38 U6.11
  Bottom 0.2: U4.6 25.86,25.9 25,25.9 24.8,26.1 v24.6,26.1 | U2.6 46.37,44.03 46.4,44 46.4,42.04 46.72,41.71 48.09,41.71 48.1,41.7 48.1,37.2 v48.3,37 | U3.6 52.06,25.96 v52.1,26
  Bottom 0.203: U1.6 21.16,44.03 v21.2,44 | U2.6 43.94,44.03 v43.9,44
D8/WS2812  (via drill 0.35)
  Top 0.152: R18.1 68.35,3.95 66.7,2.3 62.6,2.3 v62.3,2
  Bottom 0.152: v62.3,2 62.3,3.32 U6.12
D9/XLAT  (via drill 0.35)
  Top 0.152: 48.7,27.9 48.1,27.3 48.1,20.9 49.9,19.1 50.5,19.1 51.2,19.8 51.8,19.8 v52.3,19.3 | v58.9,16 58.9,13.07 57.1,11.27 57.1,10.93 57.33,10.7 58.9,10.7 61.4,8.2 61.4,5.8 v61.7,5.5
  Top 0.2: v18.4,41.7 18.4,41.3 18.38,41.28 18.38,32.52 21.6,29.3 v23.6,29.3 | v43.9,42.1 43.9,40.4 44.2,40.1 47.4,40.1 47.4,31.23 47.62,31 47.62,29.57 48.4,28.8 48.4,28.2 48.7,27.9 v49.6,27.9
  Bottom 0.152: v52.3,19.3 57.7,19.3 | 57.6,19.3 57.7,19.3 | 57.7,19.3 58.9,18.1 v58.9,16 | U6.13 61.46,5.26 v61.7,5.5
  Bottom 0.2: U1.3 18.78,42.08 v18.4,41.7 | v23.6,29.3 23.8,29.3 25.1,28 25.84,28 U4.3 28.18,27.92 28.3,27.9 29.3,28.9 29.3,36.9 33,40.6 40.3,40.6 41.9,42.2 43.8,42.2 43.92,42.08 | U3.3 49.62,27.92 v49.6,27.9
  Bottom 0.203: U2.3 43.92,42.08 v43.9,42.1
D10/BLANK  (via drill 0.35)
  Top 0.152: v54.2,29.1 56.53,29.1 57.5,29.1 v57.7,29.3 | v58,13.2 56.7,11.9 56.7,10.7 57.2,10.2 58.9,10.2 60.9,8.2 60.9,5.9 v60.7,5.7
  Top 0.2: v18.9,41.2 18.9,32.7 21.8,29.8 v24.1,29.8 | v39.8,41.1 41.2,41.1 41.6,41.4 v43.4,41.4 43.6,41.2 43.6,40.28 44.08,39.8 47.1,39.8 47.1,31.1 47.33,30.88 47.33,28.98 v47.5,28.8
  Bottom 0.152: U3.2 53.68,28.58 v54.2,29.1 | v57.7,29.3 60.6,29.3 61.1,28.8 61.1,15.5 60.7,15.1 59.9,15.1 v58,13.2 | v60.7,5.7 60.7,3.37 U6.14
  Bottom 0.2: U1.2 19.12,41.42 v18.9,41.2 | v24.1,29.8 25.4,28.5 25.84,28.5 U4.2 28.38,28.58 28.9,29.1 28.9,37.2 32.8,41.1 v39.8,41.1 | v47.5,28.8 48.5,28.8 48.7,28.6 50.9,28.6 U3.2
  Bottom 0.203: U2.2 43.92,41.42 v43.4,41.4
D11/MOSI/SIN  (via drill 0.35)
  Top 0.152: v33.3,6 36.27,3.03 36.27,0.62 36.52,0.37 36.73,0.37 38.38,0.37 38.52,0.52 38.75,0.75 39.1,0.8 42.4,0.8 v43.5,1.9
  Top 0.2: v17.5,42.8 17.5,25.3 v15.4,23.2
  Bottom 0.152: U6.15 59.86,1.96 59.55,1.65 59.5,1.6 59.4,1.5 44,1.5 43.6,1.9 v43.5,1.9
  Bottom 0.2: U1.5 18.07,43.37 v17.5,42.8 | v15.4,23.2 15.4,9.7 20.7,4.4 29.6,4.4 30.6,5.4 32.7,5.4 v33.3,6 34.34,7.04 U$3.4
D12/MISO
  Bottom 0.152: U6.16 52.51,3.35 52.37,3.2 37.01,3.2 U$3.1
D13/SCK  (via drill 0.35)
  Top 0.152: 21.1,29.2 21.1,29.1 21.1,20.7 21.5,20.3 39.5,20.3 39.5,15 40.4,14.1 40.4,12.8 v40.7,12.1 | v55.3,3.9 55.3,3.5 53.9,2.1 48.15,2.1 47.77,1.72 45.58,1.72 v44.9,2.4 46.38,5.02 47.77,5.02 47.88,5.13 47.88,6.27 47.77,6.38 39.22,6.38 v39.2,6.4
  Top 0.2: v18,42.3 18,41.9 17.98,41.88 17.98,32.33 21,29.3 | 21.35,28.95 21.6,28.7 v22.9,28.7 | v38.9,40 38.9,41.2 40.4,42.7 v43.9,42.7 | v47.9,36.5 47.9,31.15 47.92,31.12 47.92,30.57 48.3,30.2 51.6,30.2 52.2,29.6 v52.2,27.3
  Top 0.203: 21.35,28.95 21,29.3 21.1,29.2 21.1,29.1
  Bottom 0.152: v40.7,12.1 40.7,9 38.95,7.25 | 38.95,7.25 37.8,6.1 34.9,6.1 34.3,5.5 34.3,3.8 34.4,3.7 34.4,3.13 U$3.3 | U6.17 56.07,4.67 v55.3,3.9 | v39.2,6.4 39.2,7 38.95,7.25
  Bottom 0.2: U1.4 18.41,42.71 v18,42.3 | v22.9,28.7 23.9,28.7 24.8,27.8 24.8,27.6 25.1,27.3 25.91,27.3 U4.4 26.18,27.54 26.74,27.54 26.8,27.6 28.27,27.6 28.37,27.58 28.39,27.6 28.42,27.6 28.49,27.67 28.57,27.73 28.58,27.75 29.6,28.78 29.6,36.6 33.1,40 v38.9,40 | U2.4 46.1,42.71 46.1,41.91 46.6,41.41 47.79,41.41 47.8,41.4 47.8,36.6 v47.9,36.5 | v52.2,27.3 50.94,27.3 U3.4
  Bottom 0.203: U2.4 43.91,42.71 v43.9,42.7
GND  (via drill 0.35)
  Top 0.406: C26.2 31.61,66.9 36.7,66.9 37.45,66.15 WS4.GND | C3.2 3.5,37.5 3.5,39.8 | 47.2,8 47.2,7.9 47.1,7.8 46.9,7.8 46.6,7.5 46.3,7.5
  Bottom 0.152: U6.5 64.85,7.05 64.7,7.2 64.7,8.6 64.8,8.7 65.94,8.7 U6.3
  Bottom 0.2: U1.1 20.88,40.78 22.1,42
  Bottom 0.203: U$1.1 2.33,39.83 2.3,39.8 | R3.1 50,35.5
  Bottom 1.016: U$2.2 U$2.8
  other vias: 55.2,5.2 25.9,30.5 25.6,34.3 49,49.2 3.5,42.3 46.6,10.2 52.1,33.5 49.1,39.3 45.4,38.8 55.6,8.1 42.6,17.1 49.8,25
  pour Top: -1.2,71.1 -1.2,-1.3 71.1,-1.3 71.3,-1.1 71.3,71.1
  pour Bottom: -0.2,70.2 -0.2,-0.4 70.3,-0.4 70.3,70.3 -0.2,70.3
N$1  (via drill 0.35)
  Top 0.203: D1.1 v12.9,35
  Bottom 0.203: U1.7 18.07,44.67 16.9,43.5 16.9,41.4 13.8,38.3 13.8,35.9 v12.9,35
N$2
  Bottom 0.2: R1.2 23.75,37.95 24.7,38.9 24.7,41.1 25,41.4 25.9,41.4 U1.27
N$3  (via drill 0.35)
  Top 0.203: D2.1 12.94,37.26 v13,37.2
  Bottom 0.203: U1.8 18.23,45.33 16.5,43.6 16.5,41.8 13.2,38.5 13.2,37.4 v13,37.2
N$4  (via drill 0.35)
  Top 0.203: D8.1 17.76,49.64 v18.2,49.2
  Bottom 0.203: U1.14 18.22,49.22 v18.2,49.2
N$5  (via drill 0.35)
  Top 0.203: D3.1 13.29,39.51 v13.4,39.4
  Bottom 0.203: U1.9 18.27,45.97 16.1,43.8 16.1,42.1 v13.4,39.4
N$6  (via drill 0.35)
  Top 0.2: D9.1 20.09,51.31 v20.5,50.9
  Bottom 0.2: U1.15 22.18,49.22 v20.5,50.9
N$7  (via drill 0.35)
  Top 0.203: D4.1 13.8,41.7 v14.1,41.4
  Bottom 0.203: U1.10 18.33,46.63 15.7,44 15.7,43 v14.1,41.4
N$8  (via drill 0.35)
  Top 0.2: D10.1 20.96,52.84 v21.6,52.2
  Bottom 0.2: U1.16 27.08,48.58 27.4,48.9 27.4,49.5 27,49.9 23.9,49.9 v21.6,52.2
N$9  (via drill 0.35)
  Top 0.203: D5.1 14.27,43.83 v14.6,43.5
  Bottom 0.203: U1.11 18.39,47.29 v14.6,43.5
N$10  (via drill 0.35)
  Top 0.203: D6.1 15.33,45.87 v15.8,45.4
  Bottom 0.203: U1.12 18.32,47.92 v15.8,45.4
N$11  (via drill 0.35)
  Top 0.203: D7.1 16.38,47.82 v16.9,47.3
  Bottom 0.203: U1.13 18.18,48.58 v16.9,47.3
N$12  (via drill 0.35)
  Top 0.2: D11.1 22.32,54.19 v23.2,53.3
  Bottom 0.2: U1.17 27.02,47.92 27.8,48.7 27.8,49.8 27.4,50.2 26.1,50.2 v23.2,53.3
N$13  (via drill 0.35)
  Top 0.2: D12.1 24.13,54.37 v25.7,52.8
  Bottom 0.2: U1.18 27.09,47.29 28.3,48.5 28.3,49.9 27.7,50.5 27.7,50.8 v25.7,52.8
N$14  (via drill 0.35)
  Top 0.2: D13.1 26.17,53.93 v27.2,52.9
  Bottom 0.2: U1.19 27.03,46.63 28.7,48.3 28.7,51.4 v27.2,52.9
N$15  (via drill 0.35)
  Top 0.2: D14.1 28.3,56.3 v29,55.6
  Bottom 0.2: U1.20 26.2,46.25 27.07,46.25 29,48.18 v29,55.6
N$16  (via drill 0.35)
  Top 0.2: D15.1 30.5,55.8 v30.8,55.5
  Bottom 0.2: U1.21 26.18,45.59 26.84,45.59 29.3,48.05 29.3,54 v30.8,55.5
N$17  (via drill 0.35)
  Top 0.2: D16.1 32.74,56.46 v32.8,56.4
  Bottom 0.2: U1.22 26.2,44.95 26.74,44.95 29.6,47.81 29.6,53.2 v32.8,56.4
N$18
  Bottom 0.2: R2.2 19.05,37.95 20.1,39 23.5,39 24.3,39.8 24.3,41.2 24.8,41.7 24.8,43.8 25,44 25.89,44 U1.23
N$19  (via drill 0.35)
  Top 0.254: D17.1 v35,56.9
  Bottom 0.254: U2.7 44.82,44.92 44.17,44.92 40.3,48.8 40.3,51.6 v35,56.9
N$20  (via drill 0.35)
  Top 0.254: D18.1 37.26,56.66 v37.2,56.6
  Bottom 0.254: U2.8 44.27,45.33 40.69,48.91 40.69,53.11 v37.2,56.6
N$21  (via drill 0.35)
  Top 0.254: D19.1 39.51,56.41 v39.3,56.2
  Bottom 0.254: U2.9 44.82,46.22 43.88,46.22 41.05,49.05 41.05,54.45 v39.3,56.2
N$22  (via drill 0.35)
  Top 0.254: D20.1 41.7,56.1 v41.4,55.8
  Bottom 0.254: U2.10 43.97,46.63 41.4,49.2 v41.4,55.8
N$23  (via drill 0.35)
  Top 0.254: D21.1 43.83,55.13 v42.8,54.1
  Bottom 0.254: U2.11 44.85,47.52 43.68,47.52 42.45,48.75 42.45,53.75 v42.8,54.1
N$24  (via drill 0.35)
  Top 0.254: D22.1 45.87,53.57 v44.7,52.4
  Bottom 0.254: U2.12 43.78,47.92 42.8,48.9 42.8,50.5 v44.7,52.4
N$25  (via drill 0.35)
  Top 0.254: D23.1 47.82,53.92 v47.1,53.2
  Bottom 0.254: U2.13 44.12,48.58 43.8,48.9 43.8,49.9 v47.1,53.2
N$26  (via drill 0.35)
  Top 0.254: D24.1 49.64,51.74 v49.4,51.5
  Bottom 0.254: U2.14 47.12,49.22 v49.4,51.5
N$27  (via drill 0.35)
  Top 0.2: D25.1 51.31,50.31 v51,50
  Bottom 0.2: U2.15 50.92,49.92 v51,50
N$28  (via drill 0.35)
  Top 0.2: D26.1 52.84,49.04 v52.4,48.6
  Bottom 0.2: U2.16 52.38,48.58 v52.4,48.6
N$29  (via drill 0.35)
  Top 0.2: D27.1 53.81,47.81 v53.2,47.2
  Bottom 0.2: U2.17 52.48,47.92 v53.2,47.2
N$30  (via drill 0.35)
  Top 0.203: v27.8,43.4 v43.9,43.4
  Bottom 0.203: U1.24 27.77,43.37 v27.8,43.4 | U2.5 43.93,43.37 v43.9,43.4
N$31  (via drill 0.35)
  Top 0.2: D28.1 54.57,45.87 v54.1,45.4
  Bottom 0.2: U2.18 52.21,47.29 v54.1,45.4
N$32  (via drill 0.35)
  Top 0.2: D29.1 55.63,43.83 v55.3,43.5
  Bottom 0.2: U2.19 52.27,46.63 53.2,45.7 53.2,45.4 54,44.6 54.2,44.6 v55.3,43.5
N$33  (via drill 0.35)
  Top 0.2: D30.1 56.1,41.7 v55.9,41.5
  Bottom 0.2: U2.20 52.34,45.97 52.8,45.5 52.8,45.3 55.8,42.3 55.8,41.6 v55.9,41.5
N$34  (via drill 0.35)
  Top 0.2: D31.1 56.6,39.5 v56.4,39.3
  Bottom 0.2: U2.21 52.17,45.33 55.1,42.4 55.1,40.6 v56.4,39.3
N$35  (via drill 0.35)
  Top 0.2: D32.1 56.76,37.26 v56.7,37.2
  Bottom 0.2: U2.22 52.23,44.67 54.6,42.3 54.6,39.3 v56.7,37.2
N$36
  Bottom 0.2: U2.27 50.12,41.42 50,41.3 50,41.06 49.98,41.04 49.98,40.52 50,40.51 R3.2
N$37
  Bottom 0.2: U2.23 52.06,44.03 54,42.1 R4.2
N$38  (via drill 0.35)
  Top 0.2: v48.6,37.6 48.6,37.3 48.73,37.18 48.73,31.07 49,30.8 51.85,30.8 52.92,29.72 52.92,27.57 v53.1,27.4
  Bottom 0.2: U2.24 49.53,43.37 49.5,43.4 49.5,41.94 49.28,41.71 48.51,41.71 48.4,41.6 48.4,37.8 v48.6,37.6 | v53.1,27.4 53.1,27.3 52.4,26.6 50.95,26.6 U3.5
N$39  (via drill 0.35)
  Top 0.2: D33.1 58.07,34.47 v57.5,33.9
  Bottom 0.2: U3.7 52.43,25.33 52.7,25.6 52.7,25.9 54.1,27.3 54.1,27.9 55.5,29.3 55.5,30.3 56.5,31.3 56.5,32.9 v57.5,33.9
N$40  (via drill 0.35)
  Top 0.2: D34.1 57.96,32.26 v57.4,31.7
  Bottom 0.2: U3.8 52.27,24.67 53.1,25.5 53.1,25.8 54.5,27.2 54.5,27.8 55.9,29.2 55.9,30.2 v57.4,31.7
N$41  (via drill 0.35)
  Top 0.2: D35.1 57.63,30.43 v56.7,29.5
  Bottom 0.2: U3.9 52.13,24.04 53.5,25.4 53.5,25.7 54.8,27 54.8,27.6 v56.7,29.5
N$42  (via drill 0.35)
  Top 0.2: D36.1 56.7,28.3 v55.8,27.4
  Bottom 0.2: U3.10 52.17,23.37 54,25.2 54,25.6 v55.8,27.4
N$43  (via drill 0.35)
  Top 0.2: D37.1 55.57,26.17 v54.9,25.5
  Bottom 0.2: U3.11 51.99,22.71 52.38,23.1 52.9,23.1 53.3,23.5 53.3,23.9 v54.9,25.5
N$44  (via drill 0.35)
  Top 0.2: D38.1 54.43,24.13 v53.9,23.6
  Bottom 0.2: U3.12 51.78,22.08 52.5,22.8 53.1,22.8 v53.9,23.6
N$45  (via drill 0.35)
  Top 0.2: D39.1 52.78,22.18 v52.6,22
  Bottom 0.2: U3.13 52.02,21.42 v52.6,22
N$46  (via drill 0.35)
  Top 0.2: D40.1 51.06,20.36 v50.5,19.8
  Bottom 0.2: U3.14 50.92,20.22 v50.5,19.8
N$47  (via drill 0.35)
  Top 0.2: D41.1 49.31,18.69 v49,19
  Bottom 0.2: U3.15 47.22,20.78 v49,19
N$48  (via drill 0.35)
  Top 0.2: D42.1 48.94,17.16 v48,18.1
  Bottom 0.2: U3.16 43.82,21.42 43.7,21.3 43.7,20.2 44.1,19.8 46.3,19.8 v48,18.1
N$49  (via drill 0.35)
  Top 0.2: D43.1 47.81,16.29 v47,17.1
  Bottom 0.2: U3.17 43.28,22.08 43.2,22 43.2,20 43.9,19.3 44.8,19.3 v47,17.1
N$50  (via drill 0.35)
  Top 0.2: D44.1 45.87,15.23 v45.3,15.8
  Bottom 0.2: U3.18 41.21,22.71 41,22.5 41,20.1 v45.3,15.8
N$51  (via drill 0.35)
  Top 0.2: D45.1 43.83,14.47 v43.2,15.1
  Bottom 0.2: U3.19 40.67,23.37 40.5,23.2 40.5,21.75 40.61,21.64 40.61,17.69 v43.2,15.1
N$52  (via drill 0.35)
  Top 0.2: D46.1 41.7,13.9 v41.3,14.3
  Bottom 0.2: U3.20 40.34,24.04 40.1,23.8 40.1,21.73 40.31,21.52 40.31,15.29 v41.3,14.3
N$53  (via drill 0.35)
  Top 0.203: D47.1 39.5,13.5 v39.1,13.9
  Bottom 0.203: U3.21 40.07,24.67 39.7,24.3 39.7,21.7 40.01,21.39 40.01,18.71 38.89,17.59 38.8,17.5 38.8,14.2 v39.1,13.9
N$54  (via drill 0.35)
  Top 0.203: D48.1 37.26,13.44 v37,13.7
  Bottom 0.203: U3.22 39.93,25.33 39.3,24.7 39.3,21.67 39.7,21.27 39.7,18.83 38.77,17.89 37.8,17.89 36.9,17 36.9,13.8 v37,13.7
N$55  (via drill 0.35)
  Top 0.203: v46.9,30.7 44.9,30.7 43.9,29.7 v43.9,28.7
  Bottom 0.203: R5.2 48.25,32.05 v46.9,30.7 | U3.27 44.02,28.58 v43.9,28.7
N$56
  Bottom 0.406: R6.2 52.65,32.05 50.8,30.2 47.7,30.2 46.3,28.8 46.3,26.2 46.1,26 45.11,26 U3.23
N$57
  Bottom 0.152: U4.5 26.93,26.63 27.05,26.75
  Bottom 0.2: U3.24 44.15,26.63 43.17,27.6 43.17,28.32 43,28.5 29.8,28.5 28.71,27.41 28.56,27.31 28.5,27.27 27.27,27.27 27.1,27.1 27.1,26.8 27.05,26.75 27,26.7
N$58  (via drill 0.35)
  Top 0.2: D49.1 v35,13.5
  Bottom 0.2: U4.7 27.27,25.33 29.9,22.7 29.9,16.1 30.5,15.5 33,15.5 v35,13.5
N$59  (via drill 0.35)
  Top 0.2: D50.1 32.74,13.44 v32.8,13.5
  Bottom 0.2: U4.8 27.43,24.67 29.5,22.6 29.5,16 30.4,15.1 31.2,15.1 v32.8,13.5
N$60  (via drill 0.35)
  Top 0.2: D51.1 30.5,13.7 v30.7,13.9
  Bottom 0.2: U4.9 27.46,24.04 29.1,22.4 29.1,15.5 v30.7,13.9
N$61  (via drill 0.35)
  Top 0.2: D52.1 28.3,14 v28.6,14.3
  Bottom 0.2: U4.10 27.53,23.37 28.6,22.3 v28.6,14.3
N$62  (via drill 0.35)
  Top 0.2: D53.1 26.17,15.37 v26.7,15.9
  Bottom 0.2: U4.11 27.49,22.71 28.2,22 28.2,19.6 26.7,18.1 v26.7,15.9
N$63  (via drill 0.35)
  Top 0.2: D54.1 24.13,15.23 v24.7,15.8
  Bottom 0.2: U4.12 27.42,22.08 27.7,21.8 27.7,20.2 25.5,18 25.5,16.6 v24.7,15.8
N$64  (via drill 0.35)
  Top 0.2: D55.1 22.18,16.28 v23,17.1
  Bottom 0.2: U4.13 27.18,21.42 27.2,21.4 27.2,20.5 26.9,20.2 26.1,20.2 v23,17.1 22.9,17
N$65  (via drill 0.35)
  Top 0.2: D56.1 20.36,17.46 v21.3,18.4
  Bottom 0.2: U4.14 23.68,20.78 v21.3,18.4
N$66  (via drill 0.35)
  Top 0.2: v19.7,19.7 D57.1
  Bottom 0.2: U4.15 20.08,20.08 v19.7,19.7 19.6,19.6
N$67  (via drill 0.35)
  Top 0.2: D58.1 17.26,20.36 v18,21.1
  Bottom 0.2: U4.16 18.32,21.42 v18,21.1
N$68  (via drill 0.35)
  Top 0.2: D59.1 v16.8,22.8
  Bottom 0.2: v16.8,22.8 16.8,22.1 19.26,22.1 U4.17
N$69  (via drill 0.35)
  Top 0.2: v15.9,24.8 15.32,24.8 D60.1
  Bottom 0.2: U4.18 17.39,22.71 17.39,23.01 17.1,23.3 16.4,23.3 16.2,23.5 16.2,24.5 v15.9,24.8
N$70  (via drill 0.35)
  Top 0.2: D61.1 14.37,26.17 v14.8,26.6
  Bottom 0.2: U4.19 17.63,23.37 17.3,23.7 16.7,23.7 16.6,23.8 16.6,24.8 v14.8,26.6
N$71  (via drill 0.35)
  Top 0.2: D62.1 13.6,28.3 v14.1,28.6
  Bottom 0.2: U4.20 16.96,24.04 16.9,24.1 16.9,25.3 14.2,28 14.2,28.5 v14.1,28.6
N$72  (via drill 0.35)
  Top 0.2: v14,30.8 12.57,30.7 D63.1
  Bottom 0.2: U4.21 17.33,24.67 17.3,24.7 17.3,25.5 14.8,28 14.8,28.8 14,29.6 v14,30.8
N$73  (via drill 0.35)
  Top 0.2: D64.1 13.14,32.74 v13.2,32.8
  Bottom 0.2: U4.22 17.73,25.33 17.7,25.3 17.7,25.6 15.2,28.1 15.2,28.9 14.7,29.4 14.7,31.2 v13.2,32.8
N$74
  Bottom 0.406: 20.06,28.6 U4.27 20.06,28.6 | R7.2 19.95,32.05 18.9,31 18.9,28.8 19.1,28.6 20.06,28.6
N$75
  Bottom 0.406: R8.2 17,27.1 18.1,26 20.04,26 U4.23
N$76
  Top 0.406: WS1.DOUT 65.4,31.27 64.58,32.09 64.58,33.34 66.2,34.96 66.2,35.8 68.7,38.3 WS2.DIN
N$77
  Bottom 0.406: D65.C 16.56,63.42 R10.2
N$78
  Top 0.406: WS1.DIN 66.45,22.3 R18.2
N$79
  Top 0.406: WS2.DOUT 64,45.85 64,65.9 62.2,67.7 WS3.DIN
N$80
  Top 0.406: WS4.DIN 38.7,67.45 38.7,65.9 39.15,65.45 39.15,64.51 39.33,64.34 40.58,64.34 40.64,64.4 WS3.DOUT
N$81
  Bottom 0.152: Q2.1 65.98,16.25 C17.2 68.65,14.55 68.9,14.3 68.9,7.2 67.2,5.5 66.03,5.5 U6.7
N$82  (via drill 0.35)
  Top 0.152: v52.9,12.2 v59,6.4
  Bottom 0.152: C16.1 54.28,14.55 Q2.2 52.71,16.25 52.2,16.75 49.28,16.75 48.8,16.27 48.8,15.93 49.69,15.04 52.9,15.04 v52.9,12.2 | v59,6.4 59.1,7.8 59.6,8.3 62.8,8.3 63.4,7.7 63.4,5.1 63.8,4.7 65.95,4.7 U6.8
N$83
  Top 0.406: WS4.DOUT 32.15,65 29.6,65 27.95,66.65 WS5.DIN
N$84
  Top 0.406: WS6.DIN 21.25,64.4 WS5.DOUT
N$85
  Top 0.406: WS7.DIN 1.3,35.11 0.5,35.91 0.5,38.67 0.5,40.43 0.67,40.6 3.41,40.6 4.47,39.55 WS6.DOUT
N$86
  Top 0.406: WS7.DOUT 5.49,23.66 5.49,5.61 8.8,2.3 WS8.DIN
N$87
  Top 0.406: WS8.DOUT 27.95,3.98 26.9,2.93 26.9,1.67 27.27,1.3 WS9.DIN
N$88  (via drill 0.35)
  Top 0.152: WS10.DIN 43.9,5.7 42.3,4.1 v40.7,4.1 | WS9.DOUT 37.45,4.25 v38,3.7
  Bottom 0.152: v40.7,4.1 38.4,4.1 v38,3.7
N$90
  Bottom 0.152: C2.2 52.53,7.36 53.21,6.68 54.45,6.68 54.82,7.05 U6.20
RESET  (via drill 0.35)
  Top 0.152: v62.4,10.4 62.4,2.8 v60.8,1.2
  Bottom 0.152: U6.29 62.27,10.43 v62.4,10.4 | v60.8,1.2 37.68,1.2 37.59,1.11 33.64,1.11 33.53,1.22 33.53,1.34 U$3.5
RX
  Bottom 0.406: U$2.3 9.92,61 12.8,61 13.1,61.3 13.1,65.9 14.23,67.03 R9.2
TX
  Bottom 0.406: D65.A 14.2,63.43 14.2,60.5 12.1,58.4 11.3,58.4 11.17,58.53 U$2.5
VCC  (via drill 0.35, 1)
  Top 0.152: C22.1 51.87,3.27 v52.2,3.6 | v56.4,5.8 56.4,2.6 58.5,0.5 66,0.5 69.3,3.8 69.3,4.7 v69,5 | v67.2,7 67.2,5 v67.4,4.8 | v35.6,6.7 35.6,5.8 36,5.4 39.1,5.4 39.47,5.03
  Top 0.203: D45.2 45.1,12.2 v45.5,12.6
  Top 0.406: v14.1,34 10.61,34 10.38,33.77 | v35.8,14.7 35.8,13.2 36.2,12.8 36.2,10.41 36.22,10.39 35.82,10.32 v36.4,10.4 | v57.9,36.1 59.6,36.1 59.62,36.12 | v36.1,51.7 36.1,59.71 37.27,59.71 D18.2 | v36.1,51.7 | D24.2 52.72,54.08 v53.1,53.7 | 26.84,58.26 26.84,59.16 v26.4,59.6 | WS4.VDD 32.15,69.1 29.4,69.1 | 29.4,69.1 29.3,69 29.3,66.9 29.99,66.21 C26.1 | 29.4,69.1 23.2,69.1 23.1,69 23.1,67.75 WS5.VDD 23.1,67.65 23.1,65.4 | 23.1,65.4 23.02,65.32 C27.1 | WS3.VDD 42,67.65 42,65.9 41.3,65.2 | 41.3,65.2 41.17,65.2 | 41.17,65.2 41.16,65.19 C25.1 40.52,65.19 40.53,65.2 41.17,65.2 | 41.3,65.2 42.93,65.2 43.1,65.03 43.1,63.77 43.09,63.76 43.09,58.28 | 10.34,35.38 4.92,35.38 C3.1 3.78,36.3 2.98,35.5 1.62,35.5 1.45,35.68 1.45,39.4 WS6.VDD | 23.1,65.4 v25.6,65.4 | C19.1 3.95,21.9 WS7.VDD v1.3,26.7 | WS8.VDD 28.98,2.3 C20.1 29,4.58 29,6.23 v29,7.4 | WS9.VDD 38.62,2.47 38.62,3.96 39.42,4.76 C21.1 39.47,5.03 40.14,5.7 WS10.VDD | WS2.VDD C24.1 65.44,46.09 66.2,45.33 66.2,43.57 66.03,43.4 61.42,43.4 58.93,40.91 | C23.1 WS1.VDD 67.09,27.84 | D36.2 67.09,27.84 | 67.09,27.84 67.03,27.9 v67,27.9 | v11.5,24.1 12.19,24.1 12.67,24.57
  Top 1.016: D8.2 D7.2 D6.2 D5.2 D4.2 D3.2 D2.2 10.34,35.38 D1.2 10.38,33.77 D64.2 D63.2 D62.2 D61.2 12.67,24.57 D60.2 D59.2 D58.2 D57.2 D56.2 D55.2 D54.2 D53.2 D52.2 D51.2 D50.2 arc11 D49.2 36.22,10.39 D48.2 arc11 D47.2 D46.2 D45.2 D44.2 D43.2 D42.2 D41.2 D40.2 D39.2 D38.2 D37.2 D36.2 D35.2 D34.2 D33.2 59.62,36.12 D32.2 D31.2 58.93,40.91 D30.2 D29.2 D28.2 D27.2 D26.2 D25.2 D24.2 D23.2 D22.2 D21.2 43.09,58.28 D20.2 D19.2 D18.2 D17.2 D16.2 D15.2 D14.2 26.84,58.26 D13.2 D12.2 D11.2 D10.2 D9.2 D8.2
  Top 1.27: D9.2 16.4,53.6 v15.2,53.6
  Bottom 0.152: U6.6 66.97,6.27 67.2,6.5 v67.2,7 67.2,7.6 66.9,7.9 66.02,7.9 U6.4 | v52.2,3.6 52.15,3.65 C1.2 52.15,5.15 52.8,5.8 v56.4,5.8 56.9,5.3 57.6,5.3 U6.18 | v69,5 67.6,5 v67.4,4.8 | U$3.2 36.88,7.88 v35.6,6.7
  Bottom 0.203: C12.+ 45.3,12.8 v45.5,12.6 46.9,11.2 46.9,10.5 47.03,10.38 47.03,9.73 48.85,7.91
  Bottom 0.406: R2.1 17,35.1 | 17,35.1 R8.1 | C15.1 26.85,35.1 | 26.85,35.1 C4.1 25.92,37.93 U1.28 | 23.4,35.1 26.85,35.1 | 23.4,35.1 23.4,30.4 22.9,29.9 20.76,29.9 U4.28 | 17,35.1 20.12,35.1 21.88,35.1 23.4,35.1 | 17,35.1 15.2,35.1 v14.1,34 | R11.1 37.9,20.05 37.9,21.4 34,21.4 33.95,21.35 R12.1 33.95,16.55 v35.8,14.7 | R4.1 54,35 | 54,35 R6.1 | 45.85,35.1 C14.1 45.85,29.99 U3.28 | 45.85,35.1 C13.1 | 45.85,35.1 49.12,35.1 50.9,35.1 | 54,35 53.9,35.1 50.9,35.1 | 54,35 56.2,35 57.3,36.1 v57.9,36.1 | U2.28 50.92,38.86 51.05,38.73 51.05,35.25 50.9,35.1 | R17.1 35.95,51.15 v36.1,51.7 | 51.5,54.53 C11.+ | 51.5,54.53 52.27,54.53 v53.1,53.7 | C7.1 48.85,57.18 51.5,54.53 | v26.4,59.6 25.7,58.9 C10.+ 23.85,56.38 C6.1 25.6,61.75 v25.6,65.4 | v1.3,26.7 2.45,26.7 R13.1 R14.1 R15.1 R16.1 11.12,24.48 v11.5,24.1 | C9.+ 20.3,11.55 C5.1 28.8,8 | 28.8,8 29.3,8.5 29.31,8.5 31.14,10.43 36.27,10.43 v36.4,10.4 37.2,9.1 37.2,8.47 U$3.2 | 28.8,8 29,8 v29,7.4 | C1.2 48.85,7.91 C8.1 | C18.+ 64.83,27.9 v67,27.9
  Bottom 1.016: U$2.7 U$2.9 6.29,53.49 | 6.29,53.49 U$2.10 | U$2.1 7.61,63.61 6.7,62.5 6.7,53.7 6.29,53.49
  Bottom 1.27: U$2.9 10,53.6 v15.2,53.6

### Text on the board
tNames: Saturn Pot